# Altium schematic sheet OLED.SchDoc
size A4; Author: Wojciech Gredel; CompanyName: AGH UST; Revision: 1; ProjectName: My_project1
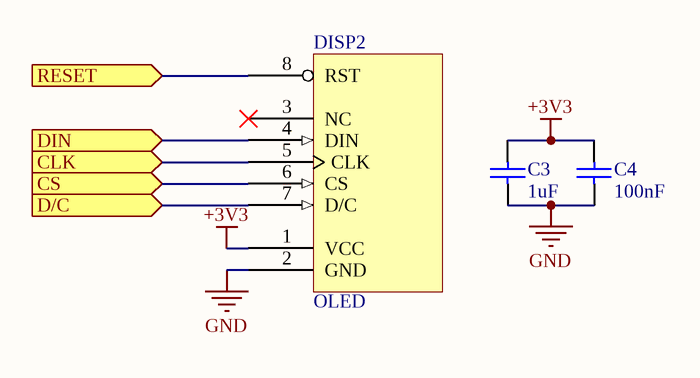
[diagram p0: OLED.SchDoc]

## Parts
C3  value 1uF  [CAP_0805_IPC_MD]  (hidden comment: Cap)
C4  value 100nF  [CAP_0805_IPC_MD]  (hidden comment: Cap)
DISP2  OLED  [OLED_1.3_INCH]

## Ports
CLK (in), CS (in), D/C (in), DIN (in), RESET (in)

## Nets
+3V3: C3.2 C4.2 DISP2.1(VCC)
GND: C3.1 C4.1 DISP2.2(GND)
CLK: DISP2.5(CLK) ; port CLK
CS: DISP2.6(CS) ; port CS
D/C: DISP2.7(D/C) ; port D/C
DIN: DISP2.4(DIN) ; port DIN
RESET: DISP2.8(RST) ; port RESET

Not connected (* = marked no-connect by the designer): DISP2 3(NC)*

## Notes on the sheet
- Confidential / Not for distribution !
- Project name:
- Document name:
- Designer Name:
- Date/Time:
- Revision:

## Library data of the parts
C3 C4 = Cap: Capacitor; Manufacturer: Samsung; Supplier: TME
  C3: Supplier Part Number: CL21B105KOFNNNF
  C4: Supplier Part Number: CL21B104KBCNNNC
DISP2 = OLED: Manufacturer: *; Manufacturer Part Number: *